# Altium schematic sheet MCU.SchDoc
size A4
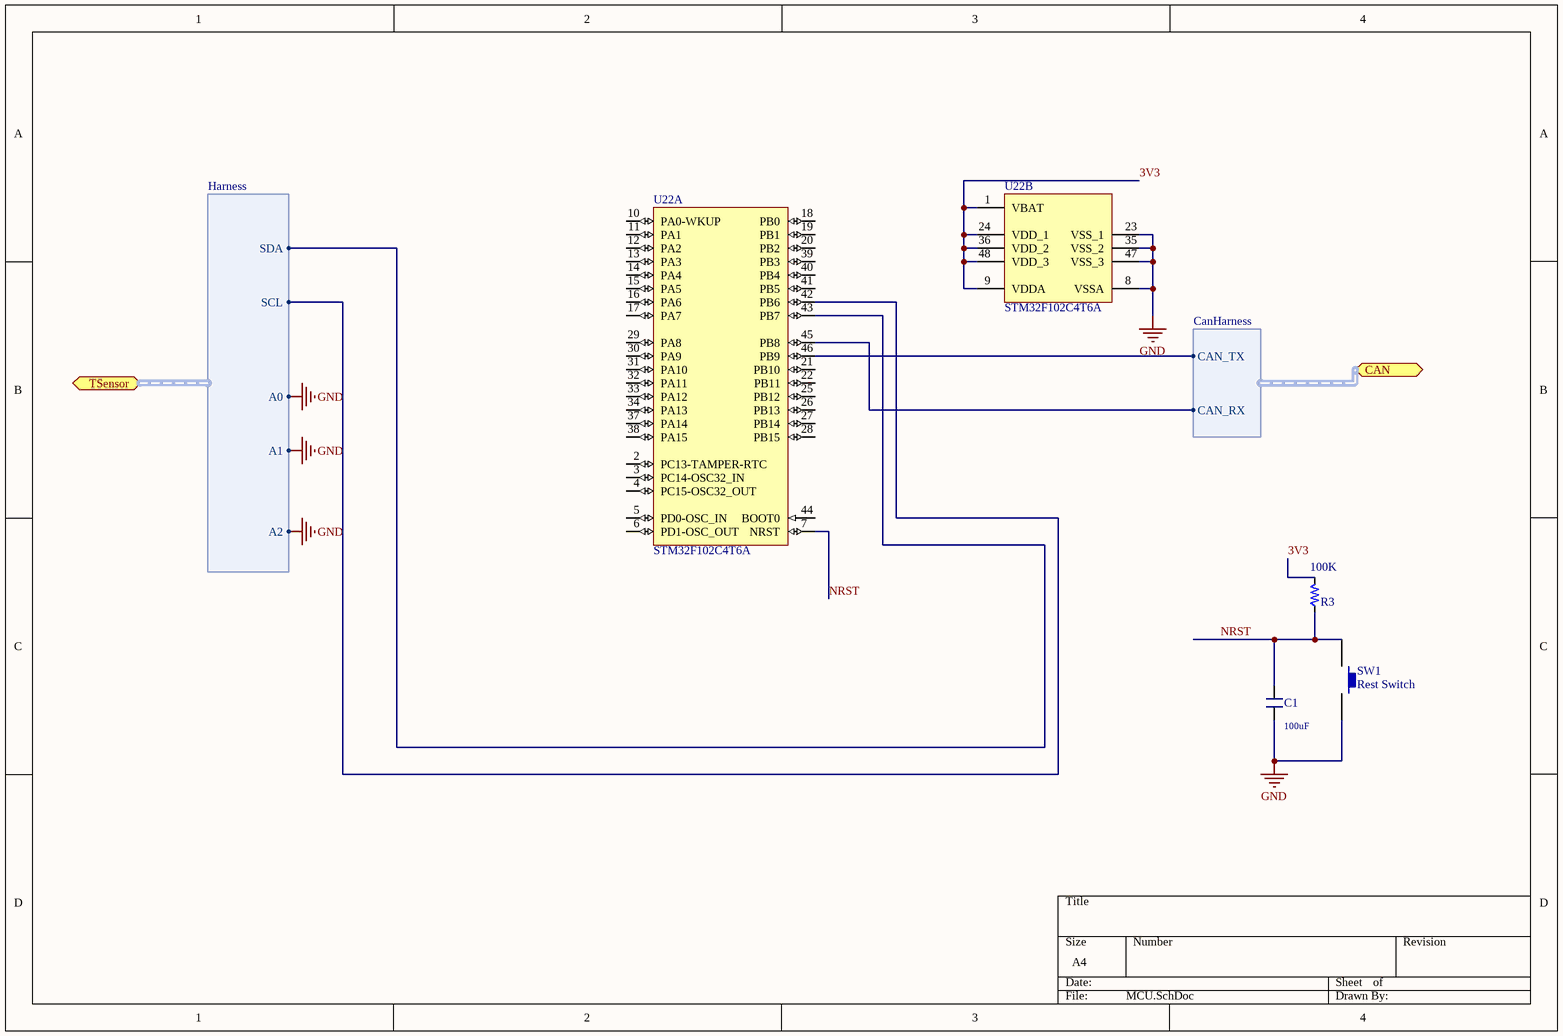
[diagram p0: MCU.SchDoc]

## Parts
C1  Capacitance: 100uF  [PCB_GENERIC_SMD_0603]  (hidden comment: SCH_GENERIC_CAPACITOR_0603)
R3  Resistance: 100K  [PCB_GENERIC_SMD_0603]  (hidden comment: SCH_GENERIC_RESISTOR_0603)
SW1  Rest Switch  [Push Button Switch]
U22  STM32F102C4T6A  [STM-LQFP48_N]  (parts A,B of 2)

## Ports
CAN (harness CanHarness), TSensor (harness Harness)

## Harnesses
Harness: SDA, A2, A1, SCL, A0
CanHarness: CAN_TX, CAN_RX

## Nets
GND: C1.1 SW1.2 U22.8(VSSA) U22.23(VSS_1) U22.35(VSS_2) U22.47(VSS_3) ; port TSensor.A2, port TSensor.A1, port TSensor.A0
3V3: R3.2 U22.1(VBAT) U22.9(VDDA) U22.24(VDD_1) U22.36(VDD_2) U22.48(VDD_3)
NRST: C1.2 R3.1 SW1.1 U22.7(NRST)
NetU22_42: U22.42(PB6) ; port TSensor.SCL
NetU22_43: U22.43(PB7) ; port TSensor.SDA
NetU22_45: U22.45(PB8) ; port CAN.CAN_RX
NetU22_46: U22.46(PB9) ; port CAN.CAN_TX

Not connected (* = marked no-connect by the designer): U22 2(PC13-TAMPER-RTC) 3(PC14-OSC32_IN) 4(PC15-OSC32_OUT) 5(PD0-OSC_IN) 6(PD1-OSC_OUT) 10(PA0-WKUP) 11(PA1) 12(PA2) 13(PA3) 14(PA4) 15(PA5) 16(PA6) 17(PA7) 18(PB0) 19(PB1) 20(PB2) 21(PB10) 22(PB11) 25(PB12) 26(PB13) 27(PB14) 28(PB15) 29(PA8) 30(PA9) 31(PA10) 32(PA11) 33(PA12) 34(PA13) 37(PA14) 38(PA15) 39(PB3) 40(PB4) 41(PB5) 44(BOOT0)

## Library data of the parts
C1 = SCH_GENERIC_CAPACITOR_0603: Generic SMD capacitor 0603; Tolerance: *%
R3 = SCH_GENERIC_RESISTOR_0603: Generic SMD resistor 0603
SW1 = PushButtonSwitch
U22 = STM32F102C4T6A: ARM Cortex-M3 32-bit MCU, 16 KB Flash, 4 KB Internal RAM, 37 I/Os, 48-pin LQFP, -40 to 85 degC, Tray; A/D Converter: 1x12-bit (10 Channel); FLASH Size (Prog) (kB): 16; I/Os (High Current): 37; Internal RAM Size (kB): 4; Operating Frequency(F) (Processor speed) (MHz): 48; Supply Voltage(Vcc) min (V): 2; DatasheetVersion: Rev. 4; PackageVersion: Rev. 6, 06/2013; PackageReference: LQFP48; PackageDescription: 48-Pin Low Profile Quad Flat Package, 7 x 7 mm Body, 0.5 mm Pitch; Supplier 1: Digi-Key; Supplier Part Number 1: 497-8305-ND; Supplier 2: Farnell; Supplier Part Number 2: 2060889; Supplier 3: Newark; Supplier Part Number 3: 65T3771; Supplier 4: Mouser; Supplier Part Number 4: 511-STM32F102C4T6A; Core: ARM Cortex-M3; Packing: Tray; Mounting Technology: Surface Mount; PartNumber: STM32F102C4T6A; ComponentLink1Description: Manufacturer URL; ComponentLink1URL: http://www.st.com/web/en/home.html; ComponentLink2Description: Datasheet; ComponentLink2URL: http://www.st.com/st-web-ui/static/active/en/resource/technical/document/datasheet/CD00210833.pdf; ComponentLink3Description: Package Specification; ComponentLink3URL: http://www.st.com/st-web-ui/static/active/en/resource/technical/document/datasheet/DM00058181.pdf